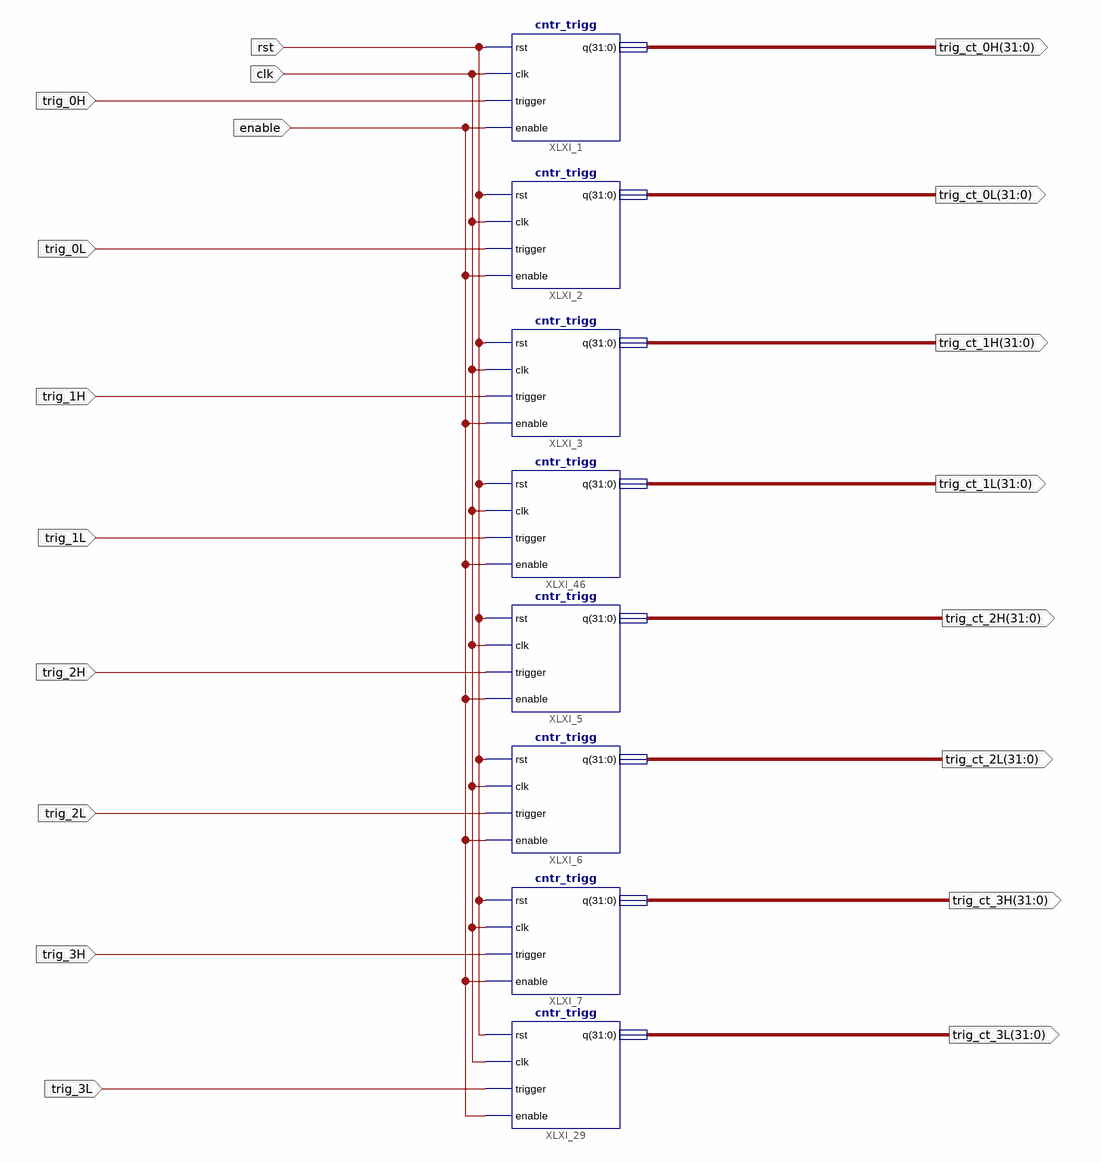
[diagram p0: schematic sheet 1]
// Xilinx ISE schematic top_trigg.sch (spartan3a) as structural Verilog: 8 symbols, 19 ports
module top_trigg (
  input  rst,
  input  clk,
  input  enable,
  input  trig_0H,
  input  trig_0L,
  input  trig_1H,
  input  trig_1L,
  input  trig_2H,
  input  trig_2L,
  input  trig_3L,
  input  trig_3H,
  output [31:0] trig_ct_0H,
  output [31:0] trig_ct_0L,
  output [31:0] trig_ct_1H,
  output [31:0] trig_ct_1L,
  output [31:0] trig_ct_2H,
  output [31:0] trig_ct_2L,
  output [31:0] trig_ct_3H,
  output [31:0] trig_ct_3L
);

  cntr_trigg XLXI_1 (.rst(rst), .clk(clk), .trigger(trig_0H), .enable(enable), .q(trig_ct_0H));
  cntr_trigg XLXI_2 (.rst(rst), .clk(clk), .trigger(trig_0L), .enable(enable), .q(trig_ct_0L));
  cntr_trigg XLXI_3 (.rst(rst), .clk(clk), .trigger(trig_1H), .enable(enable), .q(trig_ct_1H));
  cntr_trigg XLXI_5 (.rst(rst), .clk(clk), .trigger(trig_2H), .enable(enable), .q(trig_ct_2H));
  cntr_trigg XLXI_7 (.rst(rst), .clk(clk), .trigger(trig_3H), .enable(enable), .q(trig_ct_3H));
  cntr_trigg XLXI_6 (.rst(rst), .clk(clk), .trigger(trig_2L), .enable(enable), .q(trig_ct_2L));
  cntr_trigg XLXI_29 (.rst(rst), .clk(clk), .trigger(trig_3L), .enable(enable), .q(trig_ct_3L));
  cntr_trigg XLXI_46 (.rst(rst), .clk(clk), .trigger(trig_1L), .enable(enable), .q(trig_ct_1L));
endmodule
